# EAGLE design IRQF401RCT6 (EAGLE 7.6.0)
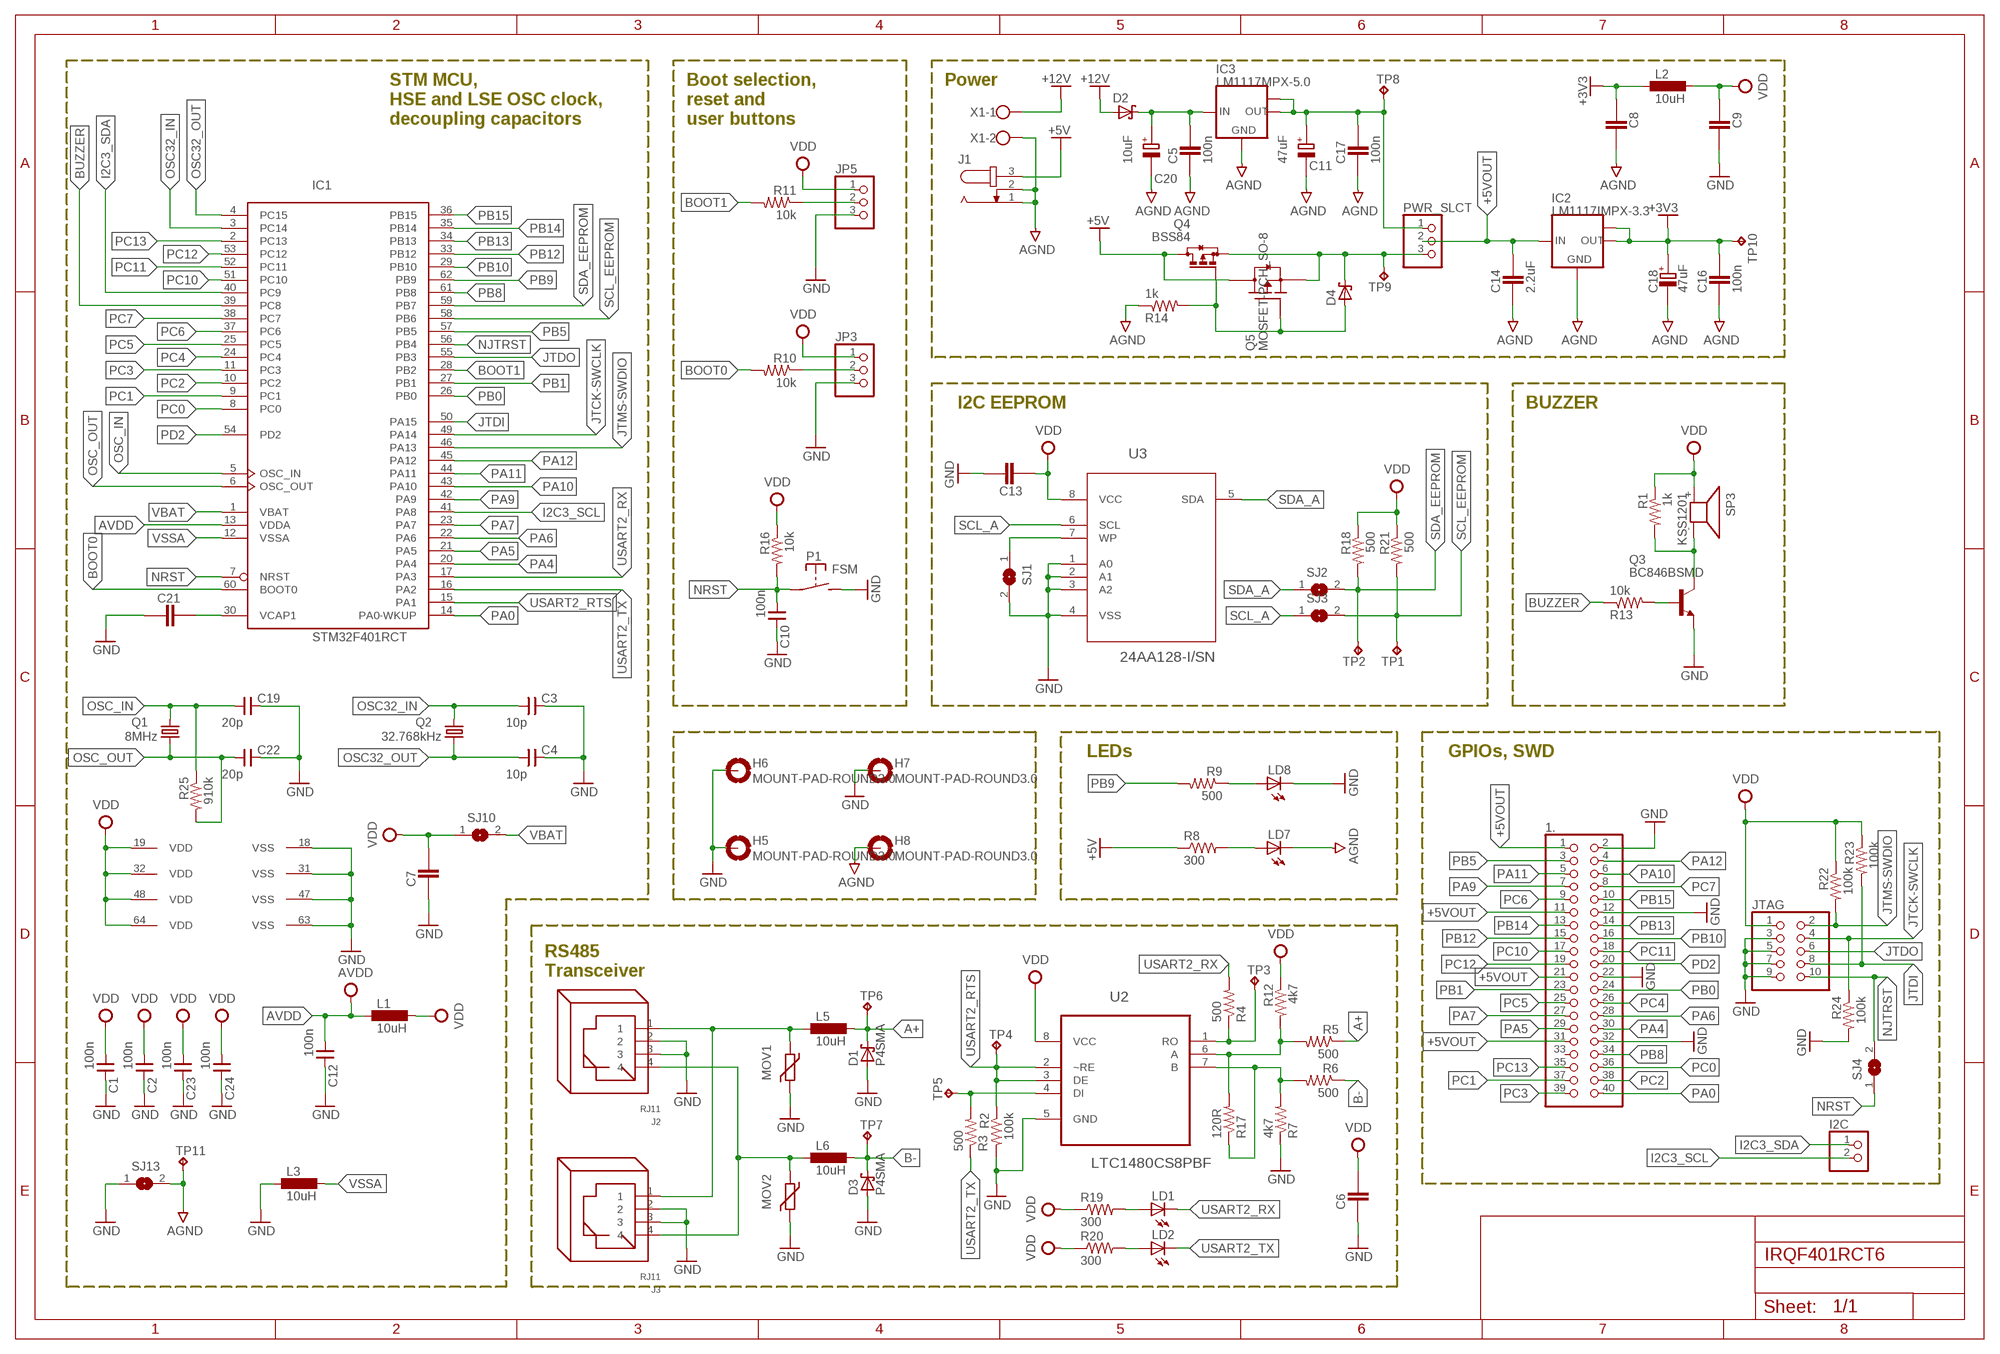
[diagram p0: schematic, sheet 1]

## Parts
1.  PINHD-2X20  [2X20]
C1  100n  CNP-0805  [0805]
C2  100n  CNP-0805  [0805]
C3  10p  CNP-0805  [0805]
C4  10p  CNP-0805  [0805]
C5  100n  CAPACITOR_0805  [CAPC2012X145AN]
C6  CAPACITOR_1206  [CAPC3215X168N]
C7  CAPACITOR_1206  [CAPC3215X168N]
C8  CAPACITOR_1206  [CAPC3215X168N]
C9  CAPACITOR_1206  [CAPC3215X168N]
C10  100n  CNP-0805  [0805]
C11  47uF  POLARISED_CASE_D  [CAPAE660X540N]
C12  100n  CNP-0805  [0805]
C13  CAPACITOR_1206  [CAPC3215X168N]
C14  2.2uF  CAPACITOR_1206  [CAPC3215X168N]
C16  100n  CAPACITOR_0805  [CAPC2012X145AN]
C17  100n  CAPACITOR_0805  [CAPC2012X145AN]
C18  47uF  POLARISED_CASE_C  [CAPAE530X540N]
C19  20p  CNP-0805  [0805]
C20  10uF  POLARISED_CASE_B  [CAPAE430X540N]
C21  CAPACITOR_1206  [CAPC3215X168N]
C22  20p  CNP-0805  [0805]
C23  100n  CNP-0805  [0805]
C24  100n  CNP-0805  [0805]
D1  P4SMA  SCHOTTKY-DIODESMD  [SMB]
D2  SCHOTTKY_SMA  [DIOM5326X292N]
D3  P4SMA  SCHOTTKY-DIODESMD  [SMB]
D4  SCHOTTKY_SMA  [DIOM5326X292N]
H5  MOUNT-PAD-ROUND3.0  [3,0-PAD]
H6  MOUNT-PAD-ROUND3.0  [3,0-PAD]
H7  MOUNT-PAD-ROUND3.0  [3,0-PAD]
H8  MOUNT-PAD-ROUND3.0  [3,0-PAD]
I2C  PINHD-1X2  [1X02]
IC1  STM32F401RCT  [LQFP64]
IC2  LM1117IMPX-3.3  [SOT223]
IC3  LM1117MPX-5.0  [SOT223]
J1  JACK-PLUG1  [SPC4078]
J2  RJ11  [RJ11]
J3  RJ11  [RJ11]
JP3  PINHD-1X3  [1X03]
JP5  PINHD-1X3  [1X03]
JTAG  PINHD-2X5  [2X05]
L1  10uH  INDUCTOR_0603  [INDC1608X95N]
L2  10uH  INDUCTOR_0603  [INDC1608X95N]
L3  10uH  INDUCTOR_0603  [INDC1608X95N]
L5  10uH  INDUCTOR_0603  [INDC1608X95N]
L6  10uH  INDUCTOR_0603  [INDC1608X95N]
LD1  LEDCHIPLED_0805  [CHIPLED_0805]
LD2  LEDCHIPLED_0805  [CHIPLED_0805]
LD7  LEDCHIPLED_0805  [CHIPLED_0805]
LD8  LEDCHIPLED_0805  [CHIPLED_0805]
MOV1  VARISTOR_0805  [VARC2012X70N]
MOV2  VARISTOR_0805  [VARC2012X70N]
P1  FSM  [FSM]
PWR_SLCT  PINHD-1X3  [1X03]
Q1  8MHz  CRYTALHC49S  [HC49/S]
Q2  32.768kHz  CRYTALTC26H  [TC26H]
Q3  BC846BSMD  [SOT23]
Q4  BSS84  [SOT23]
Q5  MOSFET-PCH_SO-8  [SOIC127P600X175-8AN]
R1  1k  R-US_M0805  [M0805]
R2  100k  R-US_M0805  [M0805]
R3  500  R-US_M0805  [M0805]
R4  500  R-US_M0805  [M0805]
R5  500  R-US_M0805  [M0805]
R6  500  R-US_M0805  [M0805]
R7  4k7  R-US_M0805  [M0805]
R8  300  R-US_M0805  [M0805]
R9  500  R-US_M0805  [M0805]
R10  10k  R-US_M0805  [M0805]
R11  10k  R-US_M0805  [M0805]
R12  4k7  R-US_M0805  [M0805]
R13  10k  R-US_M0805  [M0805]
R14  1k  R-US_M0805  [M0805]
R16  10k  R-US_M0805  [M0805]
R17  120R  R-US_M0805  [M0805]
R18  500  R-US_M0805  [M0805]
R19  300  R-US_M0805  [M0805]
R20  300  R-US_M0805  [M0805]
R21  500  R-US_M0805  [M0805]
R22  100k  R-US_M0805  [M0805]
R23  100k  R-US_M0805  [M0805]
R24  100k  R-US_M0805  [M0805]
R25  910k  R-US_M0805  [M0805]
SJ1  SJ  [SJ]
SJ2  SJ  [SJ]
SJ3  SJ  [SJ]
SJ4  SJ  [SJ]
SJ10  SJ  [SJ]
SJ13  SJ  [SJ]
SP3  KSS1201  [KSS1201]
TP1  TPTP10R  [TP10R]
TP2  TPTP10R  [TP10R]
TP3  TPTP10R  [TP10R]
TP4  TPTP10R  [TP10R]
TP5  TPTP10R  [TP10R]
TP6  TPTP10R  [TP10R]
TP7  TPTP10R  [TP10R]
TP8  TPTP10R  [TP10R]
TP9  TPTP10R  [TP10R]
TP10  TPTP10R  [TP10R]
TP11  TPTP10R  [TP10R]
U2  LTC1480CS8PBF  [SOIC127P600X175-8N]
U3  24AA128-I/SN  [SOIC127P600X175-8N]
X1  W237-102  [W237-102]

## Nets
+3V3: C8.1 C16.2 C18.+ IC2.2(OUT) IC2.TAB(OUT1) L2.1 TP10.TP
+5V: J1.3 Q4.3(D) Q5.5(D) R8.1
+5VOUT: 1..1 1..11 1..21 1..31 C14.2 IC2.3(IN) PWR_SLCT.2
+12V: D2.A X1.1
A+: D1.C L5.2 R5.1 TP6.TP
AGND: C5.1 C8.2 C11.- C14.1 C16.1 C17.1 C18.- C20.- H8.B3,0(MOUNT) IC2.1(GND) IC3.1(GND) J1.1 J1.2 LD7.C R14.1 SJ13.2 TP11.TP X1.2
AVDD: C12.1 IC1.13(VDDA) L1.1
B-: D3.C L6.2 R6.1 TP7.TP
BOOT0: IC1.60(BOOT0) R10.2
BOOT1: IC1.28(PB2) R11.2
BUZZER: IC1.39(PC8) R13.1
GND: 1..2 1..12 1..22 1..32 C1.2 C2.2 C3.2 C4.2 C6.1 C7.1 C9.2 C10.2 C12.2 C13.2 C19.2 C21.1 C22.2 C23.2 C24.2 D1.A D3.A H5.B3,0(MOUNT) H6.B3,0(MOUNT) H7.B3,0(MOUNT) IC1.18(VSS) IC1.31(VSS) IC1.47(VSS) IC1.63(VSS) J2.2 J2.3 J3.2 J3.3 JP3.3 JP5.3 JTAG.3 JTAG.5 JTAG.7 JTAG.9 L3.1 LD8.C MOV1.1 MOV2.1 P1.P$2(S) Q3.2(E) R2.2 R7.1 R24.2 SJ1.2 SJ13.1 U2.5(GND) U3.1(A0) U3.2(A1) U3.3(A2) U3.4(VSS)
I2C3_SCL: I2C.2 IC1.41(PA8)
I2C3_SDA: I2C.1 IC1.40(PC9)
JTCK-SWCLK: IC1.49(PA14) JTAG.4 R24.1
JTDI: IC1.50(PA15) JTAG.8 R23.2
JTDO: IC1.55(PB3) JTAG.6
JTMS-SWDIO: IC1.46(PA13) JTAG.2 R22.2
N$1: SJ1.1 U3.7(WP)
N$2: C21.2 IC1.30(VCAP1)
N$3: C5.2 C20.+ D2.K IC3.3(IN)
N$4: R6.2 R7.2 R17.1 U2.7(B)
N$5: JP3.2 R10.1
N$6: LD7.A R8.2
N$8: R3.2 TP5.TP U2.4(DI)
N$9: R5.2 R12.2 R17.2 U2.6(A)
N$12: J2.1 J3.1 L5.1 MOV1.2
N$13: J2.4 J3.4 L6.1 MOV2.2
N$14: R4.1 TP3.TP U2.1(RO)
N$15: LD8.A R9.1
N$17: Q3.3(C) R1.2 SP3.-
N$18: Q3.1(B) R13.2
N$20: LD1.A R19.2
N$21: LD2.A R20.2
N$22: D4.A Q4.1(G) Q5.4(G) R14.2
N$25: D4.K PWR_SLCT.3 Q4.2(S) Q5.1(S) TP9.TP
NJTRST: IC1.56(PB4) JTAG.10 SJ4.2
NRST: C10.1 IC1.7(NRST) P1.P$1(P) R16.2 SJ4.1
OSC32_IN: C3.1 IC1.3(PC14) Q2.2
OSC32_OUT: C4.1 IC1.4(PC15) Q2.1
OSC_IN: C19.1 IC1.5(OSC_IN) Q1.2 R25.1
OSC_OUT: C22.1 IC1.6(OSC_OUT) Q1.1 R25.2
PA0: 1..40 IC1.14(PA0-WKUP)
PA4: 1..30 IC1.20(PA4)
PA5: 1..29 IC1.21(PA5)
PA6: 1..28 IC1.22(PA6)
PA7: 1..27 IC1.23(PA7)
PA9: 1..7 IC1.42(PA9)
PA10: 1..6 IC1.43(PA10)
PA11: 1..5 IC1.44(PA11)
PA12: 1..4 IC1.45(PA12)
PB0: 1..24 IC1.26(PB0)
PB1: 1..23 IC1.27(PB1)
PB2: JP5.2 R11.1
PB5: 1..3 IC1.57(PB5)
PB8: 1..34 IC1.61(PB8)
PB9: IC1.62(PB9) R9.2
PB10: 1..16 IC1.29(PB10)
PB12: 1..15 IC1.33(PB12)
PB13: 1..14 IC1.34(PB13)
PB14: 1..13 IC1.35(PB14)
PB15: 1..10 IC1.36(PB15)
PC0: 1..36 IC1.8(PC0)
PC1: 1..37 IC1.9(PC1)
PC2: 1..38 IC1.10(PC2)
PC3: 1..39 IC1.11(PC3)
PC4: 1..26 IC1.24(PC4)
PC5: 1..25 IC1.25(PC5)
PC6: 1..9 IC1.37(PC6)
PC7: 1..8 IC1.38(PC7)
PC10: 1..17 IC1.51(PC10)
PC11: 1..18 IC1.52(PC11)
PC12: 1..19 IC1.53(PC12)
PC13: 1..35 IC1.2(PC13)
PD2: 1..20 IC1.54(PD2)
SCL_A: SJ3.1 U3.6(SCL)
SCL_EEPROM: IC1.58(PB6) R21.2 SJ3.2 TP1.TP
SDA_A: SJ2.1 U3.5(SDA)
SDA_EEPROM: IC1.59(PB7) R18.2 SJ2.2 TP2.TP
USART2_RTS: IC1.15(PA1) R2.1 TP4.TP U2.2(~RE) U2.3(DE)
USART2_RX: IC1.17(PA3) LD1.C R4.2
USART2_TX: IC1.16(PA2) LD2.C R3.1
VBAT: IC1.1(VBAT) SJ10.2
VCC_OUT: C11.+ C17.2 IC3.2(OUT) IC3.TAB(OUT1) PWR_SLCT.1 TP8.TP
VDD: C1.1 C2.1 C6.2 C7.2 C9.1 C13.1 C23.1 C24.1 IC1.19(VDD) IC1.32(VDD) IC1.48(VDD) IC1.64(VDD) JP3.1 JP5.1 JTAG.1 L1.2 L2.2 R1.1 R12.1 R16.1 R18.1 R19.1 R20.1 R21.1 R22.1 R23.1 SJ10.1 SP3.+ U2.8(VCC) U3.8(VCC)
VSSA: IC1.12(VSSA) L3.2
Unconnected: 1..33

## Notes on the sheet
- Power
- STM MCU, 
  HSE and LSE OSC clock,
  decoupling capacitors
- Boot selection,
  reset and
  user buttons
- I2C EEPROM | BUZZER
- LEDs | GPIOs, SWD
- RS485
  Transceiver

## Library data of the parts
1. = pinhead:PINHD-2X20: PIN HEADER
C1-C4 C10 C12 C19 C22-C24 = cap-master:CNP-: NON-POLARIZED CAP
C5-C9 C13 C14 C16 C17 C21 = ipc-7351-capacitor:CAPACITOR_
C11 C18 C20 = ipc-7351-capacitor:POLARISED_
D1 D3 = diode:SCHOTTKY-DIODE: Schottky Diode
D2 D4 = ipc-7351-diode:SCHOTTKY_
H5-H8 = holes:MOUNT-PAD-ROUND: MOUNTING PAD, round
I2C = pinhead:PINHD-1X2: PIN HEADER
IC1 = micro-stm:STM32F401R*T: ARM 32-bit Cortex™-M3 CPU 84 MHz maximum frequency 128 to 256 Kbytes of Flash memory 64 kbytes of SRAM 50 GPIOs 1.7 to 3.6 V application supply
IC2 = lm1117:LM1117IMPX-*
IC3 = lm1117:LM1117MPX-*
J1 = con-jack:JACK-PLUG: DC POWER JACK Power Jack, DC, Right Angle, Through Hole, Rated 5A at 16VDC, PC Terminals Distributor: Farnell (www.Farnell.de) Drawing: 84N1161.pdf / 84N1162.pdf Manufacturer: SPC Technology (www.spctechnology.com) Type: SPC4077 / SPC 4078
J2 J3 = con-rj:RJ11: RJ11, RJ22 RJ11 and RJ22 jacks side mounted http://www.tycoelectronics.com
JP3 JP5 PWR_SLCT = pinhead:PINHD-1X3: PIN HEADER
JTAG = pinhead:PINHD-2X5: PIN HEADER
L1-L3 L5 L6 = ipc-7351-inductor:INDUCTOR_
LD1 LD2 LD7 LD8 = led:LED: LED OSRAM: - CHIPLED LG R971, LG N971, LY N971, LG Q971, LY Q971, LO R971, LY R971 LH N974, LH R974 LS Q976, LO Q976, LY Q976 LO Q996 - Hyper CHIPLED LW Q18S LB Q993, LB Q99A, LB R99A - SideLED LS A670, LO A670, LY A670, LG A670, LP A670 LB A673, LV A673, LT A673, LW A673 LH A674 LY A675 LS A676, LA A676, LO A676, LY A676, LW A676 LS A679, LY A679, LG A679 - Hyper Micro SIDELED® LS Y876, LA Y876, LO Y876, LY Y876 LT Y87S - SmartLED LW L88C, LW L88S LB L89C, LB L89S, LG L890 LS L89K, LO L89K, LY L89K LS L896, LA L896, LO L896, LY L896 - TOPLED LS T670, LO T670, LY T670, LG T670, LP T670 LSG T670, LSP T670, LSY T670, LOP T670, LYG T670 LG T671, LOG T671, LSG T671 LB T673, LV T673, LT T673, LW T673 LH T674 LS T676, LA T676, LO T676, LY T676, LB T676, LH T676, LSB T676, LW T676 LB T67C, LV T67C, LT T67C, LS T67K, LO T67K, LY T67K, LW E67C LS E67B, LA E67B, LO E67B, LY E67B, LB E67C, LV E67C, LT E67C LW T67C LS T679, LY T679, LG T679 LS T770, LO T770, LY T770, LG T770, LP T770 LB T773, LV T773, LT T773, LW T773 LH T774 LS E675, LA E675, LY E675, LS T675 LS T776, LA T776, LO T776, LY T776, LB T776 LHGB T686 LT T68C, LB T68C - Hyper Mini TOPLED® LB M676 - Mini TOPLED Santana® LG M470 LS M47K, LO M47K, LY M47K Source: http://www.osram.convergy.de/
MOV1 MOV2 = varistor:VARISTOR_: MLA Varistor Series. The MLA Series (also known as "ML" series) family of transient voltage surge suppression devices is based on the Littelfuse Multilayer fabrication technology.
P1 = switch-misc:FSM: TYCO SWITCH
Q1 Q2 = crystal:CRYTAL: CRYSTAL
Q3 = transistor-npn:BC846*: NPN Transistor
Q4 = transistor-small-signal:BSS84: P-CHANNEL MOS FET
Q5 = ipc-7351-transistor:MOSFET-PCH_
R1-R14 R16-R25 = resistor:R-US_: RESISTOR, American symbol
SJ1-SJ4 SJ10 SJ13 = jumper:SJ: SMD solder JUMPER
SP3 = buzzer:KSS1201: SPEAKER Source: Schukat
TP1-TP11 = testpad:TP: Test pad
U2 = LTC_By_element14_Batch_1:LTC1480CS8PBF: 3.3V Ultralow Power RS485 Transceiver; MPN: LTC1480CS8#PBF; OC_FARNELL: 1663633; OC_NEWARK: 56M1547; PACKAGE: SOIC-8; SUPPLIER: Linear Technology
U3 = Microchip_By_element14_Batch_1:24AA128-I/SN: 128K I2C CMOS Serial EEPROM; DESCRIPTION: 128K I2C CMOS Serial EEPROM; MPN: 24AA128-I/SN; OC_FARNELL: -; OC_NEWARK: 92C6842; PACKAGE: SOIC-8; SUPPLIER: Microchip
X1 = con-wago-500:W237-102: WAGO SCREW CLAMP

## Board
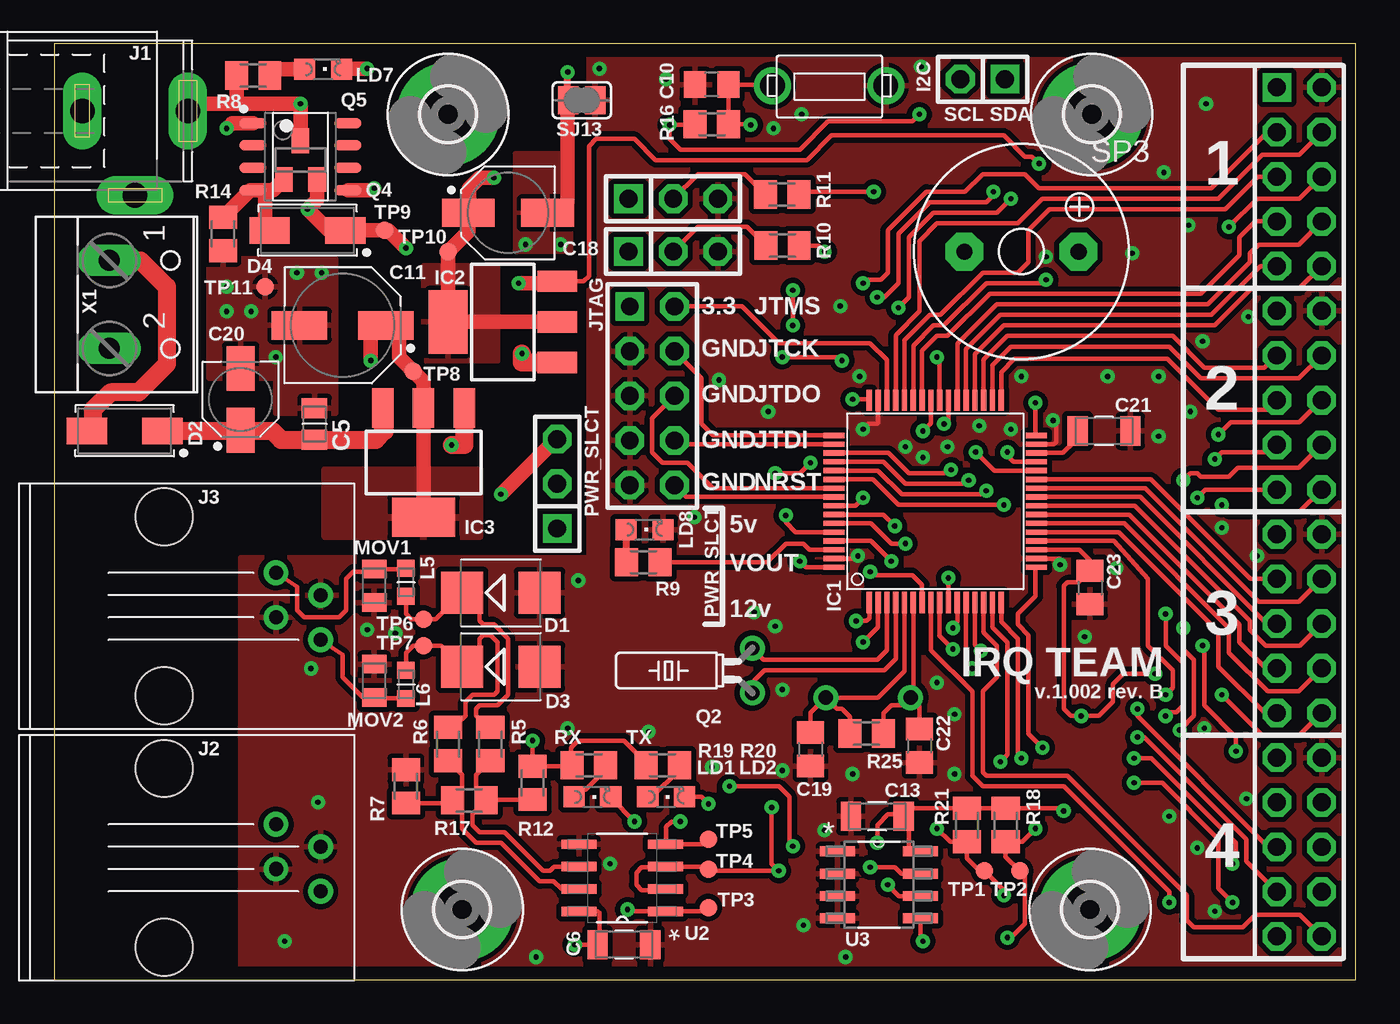
[diagram p1: board, top side]
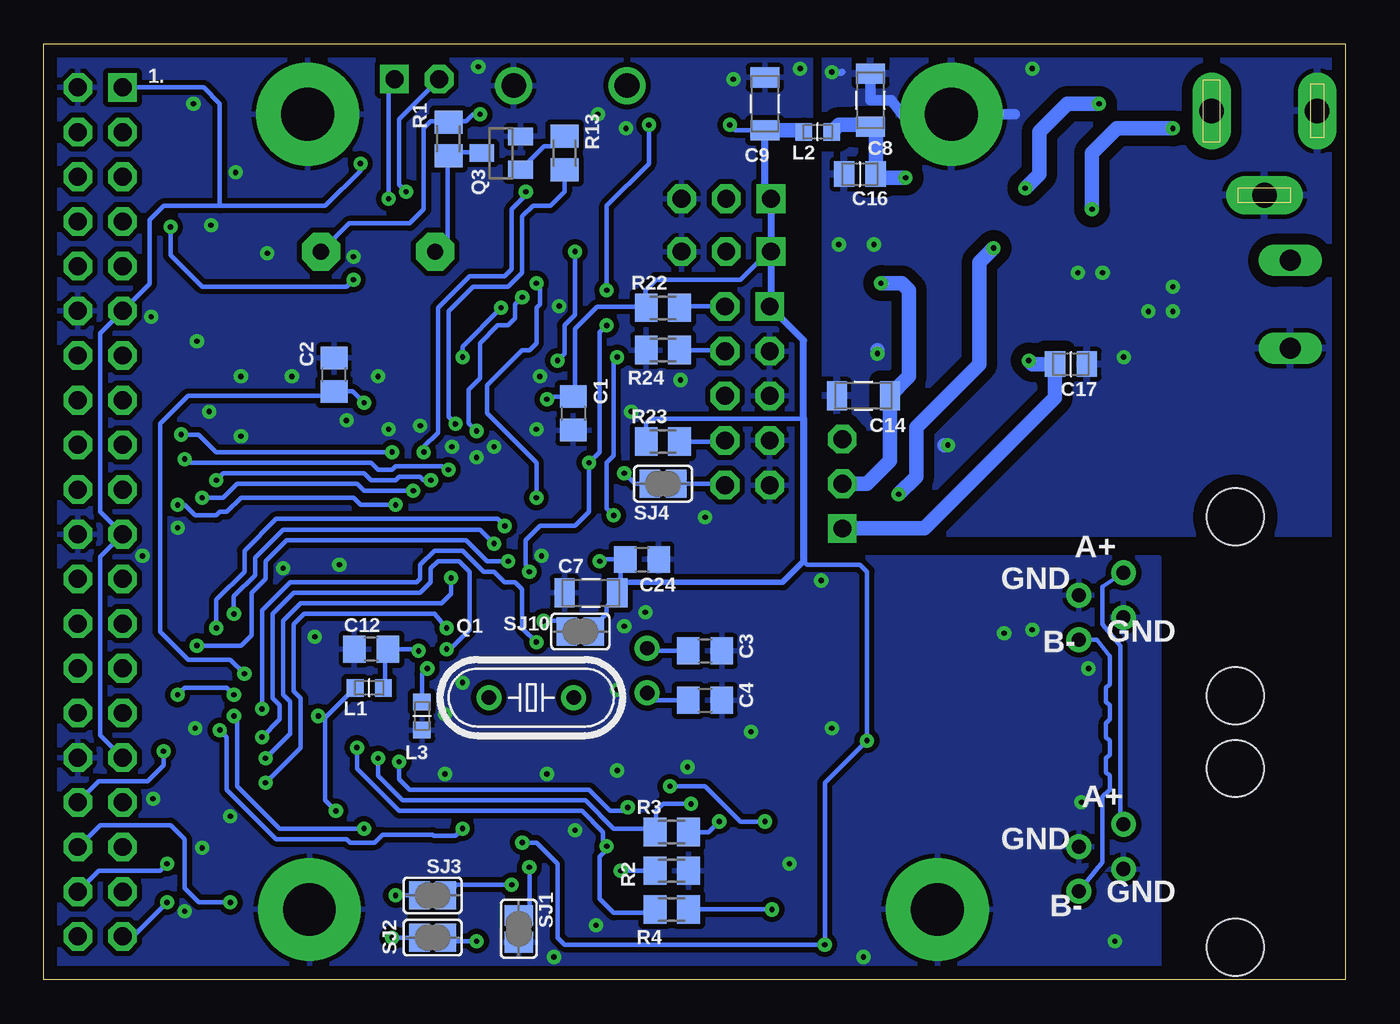
[diagram p2: board, bottom side, seen from below]

Size 74 x 53.2 mm. Coordinates in mm from the lower left corner, seen from the top.
Outline: 0,0 74,0 74,53.2 0,53.2 0,0
Copper layers (1*16): Top 0.018mm / dielectric 0.5mm / Bottom 0.018mm
Design rules "rezonit *": minimum track width 0.25mm, minimum drill 0.4mm, track to track 0.3mm, track to pad 0.3mm, pad to pad 0.3mm, via to via 0.3mm, smd to smd 0mil, copper to edge 30mil, drill to drill 8mil, minimum pad ring 12mil, minimum via ring 0.25mm, stop-mask expansion 0.06mm, vias tented up to drill 0.4mm, thermal gap 10mil

### Footprints (pad centres in the part's own frame; a part is rotated, then mirrored left to right if it is on the bottom)
2X20 = drill 1.016 square: 1 -24.13,-1.27 | drill 1.016 octagon: 2 -24.13,1.27; 3 -21.59,-1.27; 4 -21.59,1.27; 5 -19.05,-1.27; 6 -19.05,1.27; 7 -16.51,-1.27; 8 -16.51,1.27; 9 -13.97,-1.27; 10 -13.97,1.27; 11 -11.43,-1.27; 12 -11.43,1.27; 13 -8.89,-1.27; 14 -8.89,1.27; 15 -6.35,-1.27; 16 -6.35,1.27; 17 -3.81,-1.27; 18 -3.81,1.27; 19 -1.27,-1.27; 20 -1.27,1.27; 21 1.27,-1.27; 22 1.27,1.27; 23 3.81,-1.27; 24 3.81,1.27; 25 6.35,-1.27; 26 6.35,1.27; 27 8.89,-1.27; 28 8.89,1.27; 29 11.43,-1.27; 30 11.43,1.27; 31 13.97,-1.27; 32 13.97,1.27; 33 16.51,-1.27; 34 16.51,1.27; 35 19.05,-1.27; 36 19.05,1.27; 37 21.59,-1.27; 38 21.59,1.27; 39 24.13,-1.27; 40 24.13,1.27
0805 = smd 1.27 x 1.524: 1 -0.953,0; 2 0.953,0
CAPC2012X145AN = smd 1.15 x 1.45: 1 -0.9,0; 2 0.9,0
CAPC3215X168N = smd 1.15 x 1.65: 1 -1.5,0; 2 1.5,0
CAPAE660X540N = smd 3.15 x 1.6: + -2.45,0; - 2.45,0
CAPAE530X540N = smd 3 x 1.6: + -2.25,0; - 2.25,0
CAPAE430X540N = smd 2.55 x 1.6: + -1.75,0; - 1.75,0
SMB = smd 2.4 x 2.4: A 2.2,0; C -2.2,0
DIOM5326X292N = smd 2.3 x 1.5: A 2.15,0; K -2.15,0
3,0-PAD = drill 3 pad 5.842: B3,0 0,0
1X02 = drill 1.016 square: 1 -1.27,0 | drill 1.016 octagon: 2 1.27,0
LQFP64 = smd 0.3 x 1.2: 1 -3.75,-5.75; 2 -3.25,-5.75; 3 -2.75,-5.75; 4 -2.25,-5.75; 5 -1.75,-5.75; 6 -1.25,-5.75; 7 -0.75,-5.75; 8 -0.25,-5.75; 9 0.25,-5.75; 10 0.75,-5.75; 11 1.25,-5.75; 12 1.75,-5.75; 13 2.25,-5.75; 14 2.75,-5.75; 15 3.25,-5.75; 16 3.75,-5.75; 33 3.75,5.75; 34 3.25,5.75; 35 2.75,5.75; 36 2.25,5.75; 37 1.75,5.75; 38 1.25,5.75; 39 0.75,5.75; 40 0.25,5.75; 41 -0.25,5.75; 42 -0.75,5.75; 43 -1.25,5.75; 44 -1.75,5.75; 45 -2.25,5.75; 46 -2.75,5.75; 47 -3.25,5.75; 48 -3.75,5.75 | smd 1.2 x 0.3: 17 5.75,-3.75; 18 5.75,-3.25; 19 5.75,-2.75; 20 5.75,-2.25; 21 5.75,-1.75; 22 5.75,-1.25; 23 5.75,-0.75; 24 5.75,-0.25; 25 5.75,0.25; 26 5.75,0.75; 27 5.75,1.25; 28 5.75,1.75; 29 5.75,2.25; 30 5.75,2.75; 31 5.75,3.25; 32 5.75,3.75; 49 -5.75,3.75; 50 -5.75,3.25; 51 -5.75,2.75; 52 -5.75,2.25; 53 -5.75,1.75; 54 -5.75,1.25; 55 -5.75,0.75; 56 -5.75,0.25; 57 -5.75,-0.25; 58 -5.75,-0.75; 59 -5.75,-1.25; 60 -5.75,-1.75; 61 -5.75,-2.25; 62 -5.75,-2.75; 63 -5.75,-3.25; 64 -5.75,-3.75
SOT223 = smd 1.219 x 2.235: 1 -2.311,-3.099; 2 0,-3.099; 3 2.311,-3.099 | smd 3.6 x 2.2: TAB 0,3.099
SPC4078 = drill 1.4 pad 2.184 long: 1 -3,0; 2 0,-4.8; 3 3,0
RJ11 = drill 0.8: 1 -3.81,-2.54; 2 -6.35,-1.27; 3 -3.81,0; 4 -6.35,1.27 | hole 3.25: 2.54,-5.715; 2.54,4.445
1X03 = drill 1.016 square: 1 -2.54,0 | drill 1.016 octagon: 2 0,0; 3 2.54,0
2X05 = drill 1.016 square: 1 -5.08,-1.27 | drill 1.016 octagon: 2 -5.08,1.27; 3 -2.54,-1.27; 4 -2.54,1.27; 5 0,-1.27; 6 0,1.27; 7 2.54,-1.27; 8 2.54,1.27; 9 5.08,-1.27; 10 5.08,1.27
INDC1608X95N = smd 0.95 x 1: 1 -0.8,0; 2 0.8,0
CHIPLED_0805 = smd 1.2 x 1.2: A 0,-1.05; C 0,1.05
VARC2012X70N = smd 1.05 x 1.4: 1 -0.95,0; 2 0.95,0
FSM = drill 1.397: P$1 0,3.25; P$2 0,-3.2
HC49/S = drill 0.813: 1 -2.413,0; 2 2.413,0
TC26H = drill 0.813: 1 -1.27,0; 2 1.27,0
SOT23 = smd 1 x 1.4: 1 -0.95,-1.1; 2 0.95,-1.1; 3 0,1.1
SOIC127P600X175-8AN = smd 1.55 x 0.6: 1 -2.7,1.905; 2 -2.7,0.635; 3 -2.7,-0.635; 4 -2.7,-1.905; 5 2.7,-1.905; 6 2.7,-0.635; 7 2.7,0.635; 8 2.7,1.905
M0805 = smd 1.3 x 1.6: 1 -0.95,0; 2 0.95,0
SJ = smd 1.168 x 1.6: 1 -0.762,0; 2 0.762,0
KSS1201 = drill 0.914 pad 2.159 octagon: + 3.251,0; - -3.251,0
TP10R = smd 1 x 1: TP 0,0
SOIC127P600X175-8N = smd 1.981 x 0.533: 1 -2.464,1.905; 2 -2.464,0.635; 3 -2.464,-0.635; 4 -2.464,-1.905; 5 2.464,-1.905; 6 2.464,-0.635; 7 2.464,0.635; 8 2.464,1.905
SOIC127P600X175-8N' = smd 1.981 x 0.559: 1 -2.362,1.905; 2 -2.362,0.635; 3 -2.362,-0.635; 4 -2.362,-1.905; 5 2.362,-1.905; 6 2.362,-0.635; 7 2.362,0.635; 8 2.362,1.905
W237-102 = drill 1.194 long: 1 -2.5,-1.27; 2 2.5,-1.27

### Placement (x,y rotation side)
1.  70.8,26.6 270 top
C1  43.9,32.2 270 bottom
C2  57.5,34.4 90 bottom
C3  36.4,18.7 0 bottom
C4  36.4,15.9 0 bottom
C5  14.8,31.6 270 top
C6  32.4,2 180 top
C7  42.9,22 0 bottom
C8  27,50 90 bottom
C9  33,49.8 90 bottom
C10  37.39,50.89 180 top
C11  16.4,37.2 180 top
C12  55.4,18.8 180 bottom
C13  46.8,9.3 180 top
C14  27.4,33.2 0 bottom
C16  27.6,45.8 0 bottom
C17  15.6,35 180 bottom
C18  25.8,43.6 0 top
C19  43,13.1 270 top
C20  10.6,33 90 top
C21  59.7,31.2 180 top
C22  49.2,13.3 270 top
C23  58.9,22.3 270 top
C24  40,23.9 0 bottom
D1  25.4,22 0 top
D2  4,31.2 180 top
D3  25.4,17.8 0 top
D4  14.4,42.6 180 top
H5  23.2,4 0 top
H6  58.9,4 0 top
H7  59,49.2 0 top
H8  22.4,49.2 0 top
I2C  52.8,51.2 180 top
IC1  50.1,27.2 0 top
IC2  25.5,37.4 90 top
IC3  21,29.4 180 top
J1  4.6,49.4 0 top
J2  8.8,6.3 180 top
J3  8.8,20.6 180 top
JP3  35.2,41.4 0 top
JP5  35.2,44.4 0 top
JTAG  34,33.2 270 top
L1  55.5,16.6 180 bottom
L2  30,48.2 180 bottom
L3  52.5,15 90 bottom
L5  20,22.6 270 top
L6  20,16.8 90 top
LD1  30.6,10.4 270 top
LD2  34.8,10.4 270 top
LD7  15.3,51.76 270 top
LD8  33.57,25.59 270 top
MOV1  18.2,22.4 90 top
MOV2  18.2,17 270 top
P1  44.09,50.83 90 top
PWR_SLCT  28.6,28.2 90 top
Q1  46.29,16.05 0 bottom
Q2  39.69,17.58 90 top
Q3  48,47 90 bottom
Q4  14,46.6 0 top
Q5  14,46.8 0 top
R1  51,47.8 270 bottom
R2  38.3,6.2 0 bottom
R3  38.3,8.4 0 bottom
R4  38.3,4 180 bottom
R5  24.8,13.4 270 top
R6  22.4,13.4 270 top
R7  20,11 270 top
R8  11.32,51.41 0 top
R9  33.5,23.74 0 top
R10  41.41,41.74 0 top
R11  41.4,44.64 0 top
R12  27.2,11.2 270 top
R13  44.4,47 90 bottom
R14  9.6,42.4 90 top
R16  37.39,48.63 0 top
R17  23.6,10.2 0 top
R18  54.1,8.8 270 top
R19  30.4,12.2 0 top
R20  34.6,12.2 0 top
R21  51.9,8.8 270 top
R22  38.8,38.2 0 bottom
R23  38.8,30.6 0 bottom
R24  38.8,35.8 180 bottom
R25  46.2,14 0 top
SJ1  47,2.9 270 bottom
SJ2  51.9,2.4 180 bottom
SJ3  51.9,4.8 180 bottom
SJ4  38.8,28.2 0 bottom
SJ10  43.5,19.8 180 bottom
SJ13  30,50 180 top
SP3  55,41.4 0 top
TP1  52.9,6.2 0 top
TP2  54.9,6.2 0 top
TP3  37.2,4.1 0 top
TP4  37.2,6.3 0 top
TP5  37.2,8 0 top
TP6  21,20.5 0 top
TP7  21,19 0 top
TP8  20.4,34.6 0 top
TP9  18.8,42.6 0 top
TP10  22.4,41.4 0 top
TP11  12,39.4 0 top
U2  32.3,5.8 180 top
U3  24AA128-I/SN  [SOIC127P600X175-8N']  46.9,5.4 0 top
X1  4.4,38.4 270 top

### Tracks (layer width: path | path; a pad name or v marks a point on that pad's centre or on a via)
+3V3  (via drill 0.3)
  Top 0.813: IC2.2 IC2.TAB TP10.TP 23.55,42.55 C18.+ 23.6,43.65 23.6,45 24.2,45.6 v25,45.6
  Bottom 0.61: 29.2,48.1 L2.1
  Bottom 0.813: L2.1 28.8,48.6 27.1,48.6 C8.1 arc90 26.7,48.2 C16.2 arc-90 26.5,45.6 v25,45.6
  pour Top: 21,40.6 25.2,40.6 25.2,35.2 21,35.2
+5V  (via drill 0.3)
  Top 0.813: J1.3 8,49.8 10.4,49.8 | 10.4,49.8 v14,49.8 Q4.3 | Q5.5 18.09,44.9 arc90 v18.2,45 | R8.1 10.37,49.83 10.4,49.8
  Bottom 0.813: v14,49.8 15.8,49.8 17.4,48.2 17.4,45.8 v18.2,45
+5VOUT  (via drill 0.3)
  Top 0.254: v56,46.4 55.6,46.8 55.2,46.8 54,48 44.2,48 42.8,46.6 34.2,46.6 33,47.8 30.8,47.8 30.4,47.4 30.4,40 30.11,39.71 IC2.3
  Top 0.813: v26.4,39.6 28.6,39.6 IC2.3
  Bottom 0.254: 1..1 64.93,50.73 64,49.8 64,44 | 1..31 70.8,13.9 70.8,24.06 1..21 70.8,26.6 70.8,36.76 1..11 68,39.56 68,43.2 67.2,44 64,44 | v56,46.4 56,46 58,44 64,44
  Bottom 0.813: PWR_SLCT.2 27.2,28.2 25.9,29.5 C14.2 24.8,34.3 24.8,39.2 25.2,39.6 v26.4,39.6
+12V
  Top 1.016: X1.1 4.9,40.9 6.4,39.4 6.4,35 4.8,33.4 3.2,33.4 2.2,32.4 2.2,31.55 D2.A
A+
  Top 0.254: L5.2 20,20.8 20.3,20.5 TP6.TP 21.7,20.5 D1.C 24.2,21 24.2,20.4 24.4,20.2 25,20.2 25.8,19.4 25.8,16.2 25.2,15.6 24.2,15.6 24,15.4 24,15 24.2,14.8 24.35,14.8 R5.1 24.85,14.35
AGND  (via drill 0.3)
  Top 0.254: 29.15,51.75 29.2,51.69 v29.2,51.6
  Top 0.406: SJ13.2 29.2,50.04 v29.2,51.6
  Top 0.813: LD7.C 16.38,51.8 v17.8,51.8 | SJ13.2 29.2,49.96 29.2,44.2 28.6,43.6 C18.-
  Top 1.016: IC2.1 26.6,35.09 v26.6,35.6 | IC3.1 23.31,30.4 v22.6,30.4
  Bottom 0.406: v29.2,51.6 28.6,51.6
  Bottom 0.61: C8.2 27,50 25.8,50 25.2,49.2 H8.B3,0 18.8,49.2
  Bottom 0.813: v26.6,35.6 26.6,35.8 | v22.6,30.4 22.8,30.4
  other vias: 12.6,35.4 11.2,38 9.8,38 9.8,39.4 13.8,40.2 15.2,40.2 26.8,41.8 28.8,41.8
  pour Bottom (isolate 0.61): -0.8,54 29.6,53.8 29.6,25.4 -0.8,25.4
  pour Top: 8.8,41 16,41 16,32.2 12.6,32.2 12.6,34.2 8.8,34.2
  pour Top: 26.2,47 29.4,47 29.4,41.4 26.2,41.4
AVDD  (via drill 0.3)
  Top 0.254: IC1.13 52.35,19.05 v52.7,18.7
  Bottom 0.254: v52.7,18.7 52.8,18.8 C12.1 54.61,18.64 54.61,16.69 arc90 L1.1
B-
  Top 0.254: R6.1 22.4,14.8 | L6.2 20,18.6 20.4,19 TP7.TP 22,19 D3.C 24.2,18.8 24.2,19.4 24.4,19.6 24.8,19.6 25.2,19.2 25.2,16.4 25,16.2 23.8,16.2 23.4,15.8 23.4,15 23.2,14.8 22.85,14.8 R6.1 | 22.55,14.35 R6.1
BOOT0  (via drill 0.3)
  Top 0.254: IC1.60 42.15,25.45 41.6,26 v41.6,26.4 | v41.4,35.4 44.6,35.4 v44.8,35.2 | R10.2 43.46,41.74 v43.8,41.4
  Bottom 0.254: v41.6,26.4 42,26.8 42,29.4 41.6,29.8 41.6,35.2 v41.4,35.4 | v43.8,41.4 43.8,37.8 44.4,37.2 44.4,35.6 v44.8,35.2
BOOT1  (via drill 0.3)
  Top 0.254: IC1.28 53.45,28.95 v52.4,30 | v46.6,44.8 42.5,44.8 R11.2
  Bottom 0.254: v52.4,30 52.4,30.3 51.6,31.1 51.6,38.2 49.8,40 47.8,40 47.4,40.4 47.4,43.8 46.6,44.6 v46.6,44.8
BUZZER  (via drill 0.3)
  Top 0.254: IC1.39 50.85,31.85 v50.6,31.6
  Bottom 0.254: v50.6,31.6 51,32 51,38 49.6,39.4 47.6,39.4 46.8,40.2 46.8,43.4 46.2,44 45.2,44 44.4,44.8 R13.1
GND  (via drill 0.3)
  Top 0.254: IC1.18 57.2,23.95 v57.2,23.6 | IC1.63 45.65,23.95 v45.7,24.1 | IC1.31 56.85,30.45 57,30.6 57,31.8 | 45.9,34.2 v45.8,34.3 | IC1.47 46.85,31.65 46.8,31.6 46.3,31.6 v46,31.3
  other vias: 13.1,2.2 31,51.8 34.8,51.2 31.6,6.6 60.4,23.4 56.8,31.8 40.9,48.4 42.6,3.1 62.8,30.9 59.9,34.3 52.6,31.5 54.4,31.3 55,34.3 61.3,41.3 44.7,38.3 63.1,45.9 56.4,41.1 49.4,29.7 62.8,34.3 66.4,25.7 63.4,9.3 65,7.5 51.2,11.7 66,3.9 43.8,8.5 67.9,37.7 65.3,36.3 64.5,42.9 49.3,51.9 36.4,26.3 65.5,49.8 48.4,30.3 50.8,30.3 64.6,32.3 50.2,16.9 51.2,15.1 45.4,11.7 41.4,11.9 29.8,22.7 33.8,14.1 29.2,14.3 17.8,19.9 19.4,19.7 39.8,20.9 41.4,16.5 37.4,12.1 65.4,14.3 67.8,10.3 58.6,19.5 40.6,32.3 37.8,34.1 68.4,24.1 45,1.3 27.4,1.3 14.6,17.7 15,10.1 42.5,49.2 41,20.1
  pour Bottom: 30.4,54 74.8,54 74.8,-0.8 10.6,-0.8 10.6,24 30.4,24
  pour Top: 30.4,54 74.8,54 74.8,-0.8 10.6,-0.8 10.6,24 30.4,24
I2C3_SCL  (via drill 0.3)
  Top 0.254: IC1.41 49.85,31.65 v49.4,31.2 | v46.8,38.8 47.2,38.8 48,39.6 48,42.4 49.8,44.2 53,44.2 53.4,44.6 v53.4,44.8
  Bottom 0.254: v49.4,31.2 49.85,31.65 49.85,33.55 49.2,34.2 49.2,36.2 48.2,37.2 47.6,37.2 47.2,37.6 47.2,38.4 v46.8,38.8 | v53.4,44.8 53.8,45.2 53.8,48.93 I2C.2
I2C3_SDA  (via drill 0.3)
  Top 0.254: IC1.40 50.35,35.25 v50.2,35.4 | v48,38.2 48.6,38.8 48.6,42.2 50,43.6 53.6,43.6 v54.4,44.4
  Bottom 0.254: v50.2,35.4 50.2,36 v48,38.2 | v54.4,44.4 54.4,50.87 I2C.1
JTCK-SWCLK
  Top 0.254: IC1.49 37.45,30.95 36.8,31.6 36.8,34.21 JTAG.4
  Bottom 0.254: R24.1 35.33,35.8 JTAG.4
JTDI
  Top 0.254: IC1.50 35.48,30.45 JTAG.8
  Bottom 0.254: R23.2 35.33,30.6 JTAG.8
JTDO
  Top 0.254: IC1.55 37.45,27.95 36,29.4 34.6,29.4 34,30 34,31.93 JTAG.6
JTMS-SWDIO
  Top 0.254: IC1.46 47.35,35.25 46.4,36.2 41.2,36.2 39.12,38.28 JTAG.2
  Bottom 0.254: R22.2 37.77,38.28 JTAG.2
N$1  (via drill 0.3)
  Top 0.254: U3.7 48.16,6.04 47.8,6.4 v46.4,6.4
  Bottom 0.254: v46.4,6.4 46.4,4 46.66,4 SJ1.1
N$2
  Top 0.254: IC1.30 57.35,29.95 58,30.6 58,31 C21.2
N$3
  Top 1.016: D2.K 10.55,31.2 C20.+ 10.65,31.2 12.4,31.2 12.9,30.7 C5.2 18.3,30.7 18.8,31.2 18.8,32.39 IC3.3
N$4
  Top 0.254: U2.7 28.84,5.17 28.4,5.6 27.6,5.6 25.4,7.8 24,7.8 23.2,8.6 23.2,9.65 R17.1 | R7.2 22.5,10.05 R17.1 | R6.2 22.35,12.65 | R6.2 22.55,12.65 | R17.1 23.2,10.95 23.2,11.65 R6.2
N$5
  Top 0.254: JP3.2 36.6,42.8 39.41,42.8 R10.1
N$6
  Top 0.813: R8.2 12.62,51.76 LD7.A
N$8  (via drill 0.3)
  Top 0.254: v35.6,9 35.1,9 34.8,8.7 34.8,7.74 U2.4 36.91,7.71 TP5.TP
  Bottom 0.254: v35.6,9 36.2,8.4 R3.2
N$9
  Top 0.254: U2.6 28.43,6.43 28.2,6.2 27.8,6.2 25.6,8.4 24.2,8.4 23.8,8.8 23.8,9.45 R17.2 | R12.2 24.6,10.25 R17.2 | R5.2 24.85,12.65 | R17.2 24,10.95 24,11.65 R5.2 | 24.85,12.45 R5.2
N$12
  Top 0.254: L5.1 19.95,23.35 MOV1.2 18.05,23.2 17,23.2 16.6,22.8 16.6,21 16.2,20.6 14.2,20.6 13.8,21 13.8,22.35 J3.1
  Bottom 0.254: J2.1 12.8,9.13 12.8,19 13.8,20.2 13.8,22.35 J3.1
N$13
  Top 0.254: L6.1 18.25,16 MOV2.2 17.55,16.05 16.4,17.2 16.4,18.48 J3.4
  Bottom 0.254: J2.4 13.8,6.68 13.8,10.4 13.4,10.8 13.4,11.6 13.6,11.8 13.6,12.6 13.4,12.8 13.4,13.6 13.6,13.8 13.6,14.6 13.4,14.8 13.4,15.6 13.6,15.8 13.6,16.6 13.4,16.8 13.4,18.4 14.13,19.33 J3.4
N$14  (via drill 0.3)
  Top 0.254: v32.6,4 32.7,3.9 U2.1 37.2,3.9 TP3.TP
  Bottom 0.254: R4.1 v32.6,4
N$15
  Top 0.406: LD8.A 32.52,23.77 R9.1
N$17
  Bottom 0.254: Q3.3 49.15,47.05 50.8,47.05 R1.2 51.05,47 51.05,42.1 SP3.-
N$18
  Bottom 0.254: Q3.1 45.55,47.4 45,47.4 44.45,47.95 R13.2
N$20
  Top 0.254: R19.2 31.35,11.95 30.2,10.8 30,10.8 29.6,10.4 LD1.A
N$21
  Top 0.254: R20.2 35.55,11.95 34,10.4 LD2.A
N$22
  Top 0.813: Q4.1 12.45,44.9 12,44.9 | 12,44.9 Q5.4 11.14,44.9 R14.2 | D4.A 12,42.85 12,44.9
N$25  (via drill 0.3)
  Top 0.813: Q5.1 10.11,48.7 v9.8,48.4 | Q4.2 14.95,44.35 v14.4,43.8 15.6,42.6 D4.K TP9.TP 19,42.6 v20,41.6 | PWR_SLCT.3 28.54,30.74 v25.4,27.6
  Bottom 0.813: v9.8,48.4 13,48.4 14.4,47 v14.4,43.8 | v25.4,27.6 24.4,28.6 24.4,31.4 20.8,35 20.8,40.8 v20,41.6
NJTRST
  Top 0.254: IC1.56 35.94,27.45 JTAG.10
  Bottom 0.254: SJ4.2 35.35,28.2 JTAG.10
NRST  (via drill 0.3)
  Top 0.254: P1.P$1 40.78,50.89 C10.1 R16.2 39.57,48.63 v39.6,48.6 | IC1.7 49.35,22.45 48.8,23 46.6,23 v46.4,23.2 | v42,37.2 v42,39.2 | v43,29.4 42.4,28.8 v41,28.8
  Bottom 0.254: v39.6,48.6 39.6,46.4 42,44 v42,39.2 | v46.4,23.2 46.4,23.4 46.6,23.6 46.6,25 45.8,25.8 43.8,25.8 43,26.6 v43,29.4 42.4,30 42.4,36.8 v42,37.2 | v41,28.8 40.4,28.2 SJ4.1
OSC32_IN
  Top 0.254: IC1.3 47.35,18.75 46.8,18.2 40.34,18.2 Q2.2
  Bottom 0.254: C3.1 39.54,18.7 Q2.2
OSC32_OUT
  Top 0.254: IC1.4 47.85,18.25 47.2,17.6 40.4,17.6 39.8,17 39.8,16.42 Q2.1
  Bottom 0.254: Q2.1 39.28,15.9 C4.1
OSC_IN
  Top 0.254: IC1.5 48.35,17.55 46.85,16.05 Q1.2 | R25.1 45.25,14.95 44.8,15.4 44.52,15.4 Q1.2 | C19.1 43,15.17 Q1.2
OSC_OUT
  Top 0.254: IC1.6 48.85,16.2 Q1.1 | R25.2 47.15,15.15 47.6,15.6 48.26,15.6 Q1.1 | C22.1 49.2,15.55 Q1.1
PA0
  Top 0.254: IC1.14 52.85,19.75 53.6,19 53.6,17.2 52.8,16.4 52.8,11.8 53,11.6 57.6,11.6 64.4,4.8 64.4,3.4 64.8,3 67.6,3 68.3,3.7 70.84,3.7 1..40
PA4  (via drill 0.3)
  Top 0.254: IC1.20 60.25,24.95 62.2,22.8 62.2,19 63.6,17.6 63.6,16.6 v63.2,16.2 | 1..30 70.8,13.9 68.7,13.9 v66.4,16.2
  Bottom 0.254: v66.4,16.2 66,16.6 63.6,16.6 v63.2,16.2
PA5
  Top 0.254: IC1.21 60.55,25.45 66.2,19.8 66.2,17.8 68.83,15.17 1..29
PA6
  Top 0.254: IC1.22 60.85,25.95 66.8,20 66.8,18.6 69,16.4 70.76,16.4 1..28
PA7
  Top 0.254: IC1.23 61.15,26.45 67.4,20.2 67.4,19.2 68.89,17.71 1..27
PA9
  Top 0.254: IC1.42 49.35,35.75 50.2,36.6 50.8,36.6 53.2,39 65.2,39 67.4,41.2 67.4,42.2 68.31,43.11 1..7
PA10  (via drill 0.3)
  Top 0.254: v56.4,39.8 56.2,39.6 53,39.6 50.6,37.2 50,37.2 48.85,36.05 IC1.43 | v66.8,42.8 68.4,44.4 70.8,44.4 72.05,45.65 1..6
  Bottom 0.254: v56.4,39.8 56.8,39.4 65,39.4 66.8,41.2 v66.8,42.8
PA11
  Top 0.254: IC1.44 48.35,36.35 49.8,37.8 50.4,37.8 52.8,40.2 54.8,40.2 55.4,40.8 55.4,42.6 56.6,43.8 66.6,43.8 68.45,45.65 1..5
PA12
  Top 0.254: IC1.45 47.85,36.65 49.2,38 49.2,42 50.2,43 54.8,43 56.2,44.4 66.2,44.4 68.7,46.9 70.8,46.9 72.07,48.17 1..4
PB0
  Top 0.254: IC1.26 62.05,27.95 68.5,21.5 70.78,21.5 1..24
PB1
  Top 0.254: IC1.27 62.35,28.45 68.01,22.79 1..23
PB2
  Top 0.254: JP5.2 36.6,45.8 39.29,45.8 R11.1
PB5  (via drill 0.3)
  Top 0.254: IC1.57 45.55,26.95 v46,27.4 | v46,39.6 46.2,39.8 47,39.8 47.4,40.2 47.4,42.6 49.6,44.8 51.8,44.8 52.8,45.8 55.2,45.8 56,45 65.8,45 68.99,48.19 1..3
  Bottom 0.254: v46,27.4 46,29.4 48.8,32.2 48.8,33.8 46.8,35.8 46.4,35.8 46,36.2 46,38.2 45.8,38.4 45.8,39.4 v46,39.6
PB8  (via drill 0.3)
  Top 0.254: IC1.61 46.45,24.95 v47.6,23.8 | v65.3,19 65.4,18.9 65.4,15.6 67.2,13.8 v67.2,13
  Bottom 0.254: v65.3,19 62.8,19 62.2,19.6 62.2,22 61.4,22.8 61.4,23.8 60.2,25 50,25 48.8,23.8 v47.6,23.8 | v67.2,13 67.2,12.2 68.1,11.3 70.9,11.3 72.07,10.13 1..34
PB9
  Top 0.254: IC1.62 42.95,24.45 42.6,24.8 41.6,24.8 40.54,23.74 R9.2
PB10  (via drill 0.3)
  Top 0.254: IC1.29 54.55,29.45 54.2,29.8 v54.2,30 | 1..16 72.05,32.95 70.8,31.7 66.9,31.7 v66.2,31
  Bottom 0.254: v54.2,30 64.2,30 65.2,31 v66.2,31
PB12
  Top 0.254: IC1.33 53.85,34.55 54.6,35.3 63.3,35.3 66.2,32.4 69,32.4 69.53,32.93 1..15
PB13
  Top 0.254: IC1.34 53.35,34.95 54.4,36 63.4,36 65.2,34.2 70.78,34.2 1..14
PB14
  Top 0.254: IC1.35 52.85,35.25 54.2,36.6 63.6,36.6 65.4,34.8 68.8,34.8 69.49,35.49 1..13
PB15
  Top 0.254: IC1.36 52.35,35.55 54,37.2 66,37.2 68.1,39.3 70.8,39.3 1..10
PC0  (via drill 0.3)
  Top 0.254: IC1.8 49.85,18.75 52.2,16.4 52.2,11.6 52.8,11 57.4,11 63.4,5 v63.4,4.4
  Bottom 0.254: v63.4,4.4 65.2,4.4 66,5.2 66,8 66.8,8.8 70.8,8.8 72.05,7.55 1..36
PC1  (via drill 0.3)
  Top 0.254: v51.1,18.8 50.35,19.55 IC1.9 | v61.6,13.8 62,13.8 67.8,8 67.8,6.74 1..37
  Bottom 0.254: v61.6,13.8 60.6,14.8 60.6,15.6 61,16 61,20.8 59.8,22 52.6,22 52,22.6 52,23.4 51.6,23.8 50.4,23.8 49.8,23.2 49.8,19.9 50.9,18.8 v51.1,18.8
PC2  (via drill 0.3)
  Top 0.254: v61.4,12.6 62.4,12.6 67.2,7.8 67.2,6.8 v67,6.6 | v50.85,22.85 IC1.10
  Bottom 0.254: v61.4,12.6 60,14 60,15.8 60.4,16.2 60.4,20.4 59.4,21.4 51.4,21.4 50.85,21.95 v50.85,22.85 | 1..38 70.88,6.2 67.4,6.2 v67,6.6
PC3  (via drill 0.3)
  Top 0.254: v61.4,11.2 63,11.2 66.2,8 66.2,5.2 v67,4.4 | IC1.11 51.35,20.35 v51.1,20
  Bottom 0.254: v61.4,11.2 59.4,13.2 59.4,16 59.8,16.4 59.8,20.2 59.2,20.8 51.8,20.8 v51.1,20 | 1..39 68.93,2.47 v67,4.4
PC4
  Top 0.254: IC1.24 61.45,26.95 68,20.4 68,19.9 68.9,19 70.82,19 1..26
PC5
  Top 0.254: IC1.25 61.75,27.45 68.95,20.25 1..25
PC6
  Top 0.254: IC1.37 51.85,35.85 53.8,37.8 65.8,37.8 68.57,40.57 1..9
PC7
  Top 0.254: IC1.38 51.35,36.15 53.6,38.4 65.6,38.4 68,40.8 68,41.3 68.5,41.8 70.76,41.8 1..8
PC10  (via drill 0.3)
  Top 0.254: IC1.51 47.45,29.95 48.6,28.8 50.6,28.8 v51,29 | v66,29.6 66.4,30 69.12,30 1..17
  Bottom 0.254: v51,29 51.4,29.2 54,29.2 54.2,29 55,29 55.4,29.4 65.8,29.4 v66,29.6
PC11  (via drill 0.3)
  Top 0.254: IC1.52 47.15,29.45 48.4,28.2 51.8,28.2 v52,28.4 | v64.2,28.4 64.6,28.8 65,28.8 65.2,28.6 66.8,28.6 67.3,29.1 70.76,29.1 1..18
  Bottom 0.254: v52,28.4 52.4,28.4 52.6,28.6 53.8,28.6 54,28.4 55.4,28.4 55.8,28.8 63.8,28.8 v64.2,28.4
PC12  (via drill 0.3)
  Top 0.254: IC1.53 46.85,28.95 48.2,27.6 52.8,27.6 v53,27.8 | 1..19 65.47,27.87 v65,27.4
  Bottom 0.254: v53,27.8 55.8,27.8 56.2,28.2 63,28.2 63.8,27.4 v65,27.4
PC13  (via drill 0.3)
  Top 0.254: 61.6,15.2 v61.6,15.4 61.6,15 69.05,7.55 1..35 | IC1.2 46.85,20.05 v46,19.2
  Bottom 0.254: v61.6,15.4 61.6,21 60,22.6 52.8,22.6 52.6,22.8 52.6,23.6 51.8,24.4 50.2,24.4 49,23.2 48.4,23.2 47.8,22.6 47.2,22.6 46.8,22.2 46.8,20 v46,19.2
PD2  (via drill 0.3)
  Top 0.254: v54,27 48,27 46.55,28.45 IC1.54 | v66.4,27 66.8,26.6 70.8,26.6 1..20
  Bottom 0.254: v54,27 56,27 56.4,27.4 62.8,27.4 63.6,26.6 64,26.6 64.2,26.4 65.4,26.4 66,27 v66.4,27
SCL_A  (via drill 0.3)
  Top 0.254: U3.6 48.03,4.76 v47.4,5.4
  Bottom 0.254: v47.4,5.4 50.54,5.4 SJ3.1
SCL_EEPROM  (via drill 0.3)
  Top 0.254: IC1.58 47.15,26.45 v47.8,25.8 | v50.2,8.6 50.95,7.85 R21.2 51.9,6.9 52.6,6.2 TP1.TP 54,5.1 v54,4.8 | v64,14.2 64.8,15 64.8,18.2 64.2,18.8 v64.2,20
  Bottom 0.254: v64,14.2 63.6,13.8 63.6,10.8 60.8,8 56.8,8 56.6,7.8 55.2,7.8 54.75,8.25 51.9,8.25 51.85,8.2 50.6,8.2 v50.2,8.6 | v54,4.8 SJ3.2 | v64.2,20 64.2,21.6 62.6,23.2 62.6,24.4 60.8,26.2 48.2,26.2 v47.8,25.8
SDA_A  (via drill 0.3)
  Top 0.254: U3.5 49.26,2.34 v49.4,2.2
  Bottom 0.254: v49.4,2.2 50.94,2.2 SJ2.1
SDA_EEPROM  (via drill 0.3)
  Top 0.254: IC1.59 46.45,25.95 47.6,24.8 v48.4,24.8 | v55.8,8.6 55.05,7.85 R18.2 54.1,7 TP2.TP 55.2,5.9 55.2,3.2 54.4,2.4 v54.2,2.4 | v63.2,15 63.4,15.2 63.8,15.2 64.2,15.6 64.2,18 63.2,19 v63.2,20.8
  Bottom 0.254: v63.2,15 63,14.8 63,11 60.6,8.6 v55.8,8.6 | v54.2,2.4 SJ2.2 | v63.2,20.8 63.2,21.8 62,23 62,24 60.4,25.6 49.2,25.6 v48.4,24.8
USART2_RTS  (via drill 0.3)
  Top 0.254: v40.8,9.8 40.8,6.6 v41.2,6.2 | IC1.15 53.35,20.05 54.2,19.2 54.2,12.8 v53.8,12.4 | 41.03,6.04 v41.2,6.2 | v41.2,6.2 37.2,6.2 TP4.TP 37.2,6.43 U2.3 34.76,6.4 33.4,6.4 33.1,6.1 33.1,5.4 33.4,5.1 34.7,5.1 U2.2
  Bottom 0.254: v53.8,12.4 53.8,11.4 53.2,10.8 43,10.8 41.8,9.6 41,9.6 v40.8,9.8 | v41.2,6.2 R2.1
USART2_RX  (via drill 0.3)
  Top 0.254: IC1.17 55.8,23.4 55.8,21.8 54.8,20.8 54.8,20.2 55.4,19.6 55.4,14 v56.2,13.2 | LD1.C 31.65,10.35 v33,9 | v38.4,11 41.2,11 41.8,10.4 41.8,7.8 v42,7.6
  Bottom 0.254: v56.2,13.2 56.2,12 53.8,9.6 43.4,9.6 42.2,8.4 42.2,7.8 v42,7.6 42,7.4 42.4,7 42.4,4.6 41.6,3.8 39.45,3.8 R4.2 | v33,9 34.4,9 36.4,11 v38.4,11
USART2_TX  (via drill 0.3)
  Top 0.254: IC1.16 53.85,20.35 54.8,19.4 54.8,12.8 v55,12.6 | LD2.C 36.8,10.4 v37.2,10
  Bottom 0.254: v55,12.6 55,11.6 53.6,10.2 43.2,10.2 41.6,8.6 39.25,8.6 R3.1 39.2,8.45 39.2,9.6 38.8,10 v37.2,10
VBAT  (via drill 0.3)
  Top 0.254: IC1.1 46.35,20.55 46.2,20.4 v45.6,20.4
  Bottom 0.254: v45.6,20.4 44.26,20.4 SJ10.2
VCC_OUT  (via drill 0.3)
  Top 0.813: 21,31.8 IC3.2 | IC3.2 IC3.TAB 21.1,26.4 | IC3.2 21,34 TP8.TP 19.6,35.4 19.6,37.2 C11.+ 18,37.2 v18,35.2
  Bottom 0.813: v18,35.2 17.8,35 C17.2 16.5,33.1 23.94,25.66 PWR_SLCT.1
  pour Top: 15.4,29 24.2,29 24.2,25.2 15.4,25.2
VDD  (via drill 0.3)
  Top 0.254: IC1.64 42.75,23.45 v42.4,23.8 | R16.1 36.41,48.6 v35,48.6 35,47.8 35.6,47.2 42.4,47.2 44,48.8 48.8,48.8 v49.2,49.2 | IC1.19 58.3,24.45 58.9,23.85 C23.1 58.25,22.6 57.6,22.6 57.4,22.4 57.4,15.4 57.8,15 v58.4,15 59.4,15 60.2,15.8 60.2,16.8 60.8,17.4 v62.6,17.4 | v55.8,32.8 55.8,31 IC1.32 | IC1.48 46.3,33 v45.4,33 | v57.4,9.6 57.25,9.75 R18.1 R21.1 48.75,9.75 C13.1 | U3.8 49.2,7.37 48.6,7.37 48.6,9 C13.1 | v46.8,7.8 46.8,8.8 47.4,9.4 48.2,9.4 C13.1 | v27.2,13.6 R12.1 29.4,12.15 R19.1 29.4,12.25 29.4,13.2 29.8,13.6 32.4,13.6 33.65,12.35 R20.1 | v29.6,2 C6.2 31,2.1 31,3.8 30.91,3.9 U2.8
  Bottom 0.254: SJ10.1 42.74,20.06 42,20.8 42,21.2 41.6,21.6 41.6,21.8 C7.2 41,22.4 41,22.6 41.2,22.8 41.2,23.9 C24.1 42.3,23.9 v42.4,23.8 | v62.6,17.4 63.4,18.2 65.8,18.2 67.4,19.8 67.4,31.6 65.8,33.2 58,33.2 57.75,33.45 C2.1 56.45,33.45 v55.8,32.8 | v46.8,7.8 46,7.8 44.8,6.6 44.8,2.4 44.4,2 v29.6,2 29.6,11.2 v27.2,13.6 27.2,23.2 27.6,23.6 30.6,23.6 30.8,23.8 | v45.4,33 45.25,33.15 C1.1 43.8,33.25 43.8,37 42.55,38.25 39.8,38.25 | JP3.1 32.8,41.4 34.4,39.8 39.2,39.8 39.8,39.2 39.8,38.25 | 39.8,38.25 R22.1 | R23.1 39.75,31.65 39.5,31.9 30.8,31.9 | v35,48.6 34.7,48.3 C9.1 | L1.2 57.9,15 | 57.9,15 v58.4,15 | 57.9,15 58,14.9 58,10.2 v57.4,9.6 | SP3.+ 56.65,43 53.2,43 52.4,43.8 52.4,48.4 52,48.8 51.05,48.8 R1.1 50.95,48.8 50,48.8 49.6,49.2 v49.2,49.2
  Bottom 0.305: 41,22.6 32,22.6 30.8,23.8
  Bottom 0.406: C9.1 33,44.74 JP5.1 JP3.1 32.66,38.28 JTAG.1 30.8,36.35 30.8,31.9 30.8,23.8
  Bottom 0.61: L2.2 30.9,48.1
  Bottom 0.813: C9.1 30.8,48.3 L2.2
VSSA  (via drill 0.3)
  Top 0.254: IC1.12 51.85,18.05 v52.2,17.7
  Bottom 0.254: v52.2,17.7 52.5,17.4 L3.2

### Text on the board
tPlace: SCL | SDA | 1 | 3.3 | JTMS | GND | JTCK | GND | JTDO | 2 | GND | JTDI | GND | NRST | 3 | IRQ TEAM | v.1.002 rev. B | 4
tNames: 5v | VOUT | PWR_SLCT | 12v | RX | TX
bNames: A+ | GND | GND | B- | A+ | GND | GND | B-
tValues: RST | BOOT1 | BOOT0